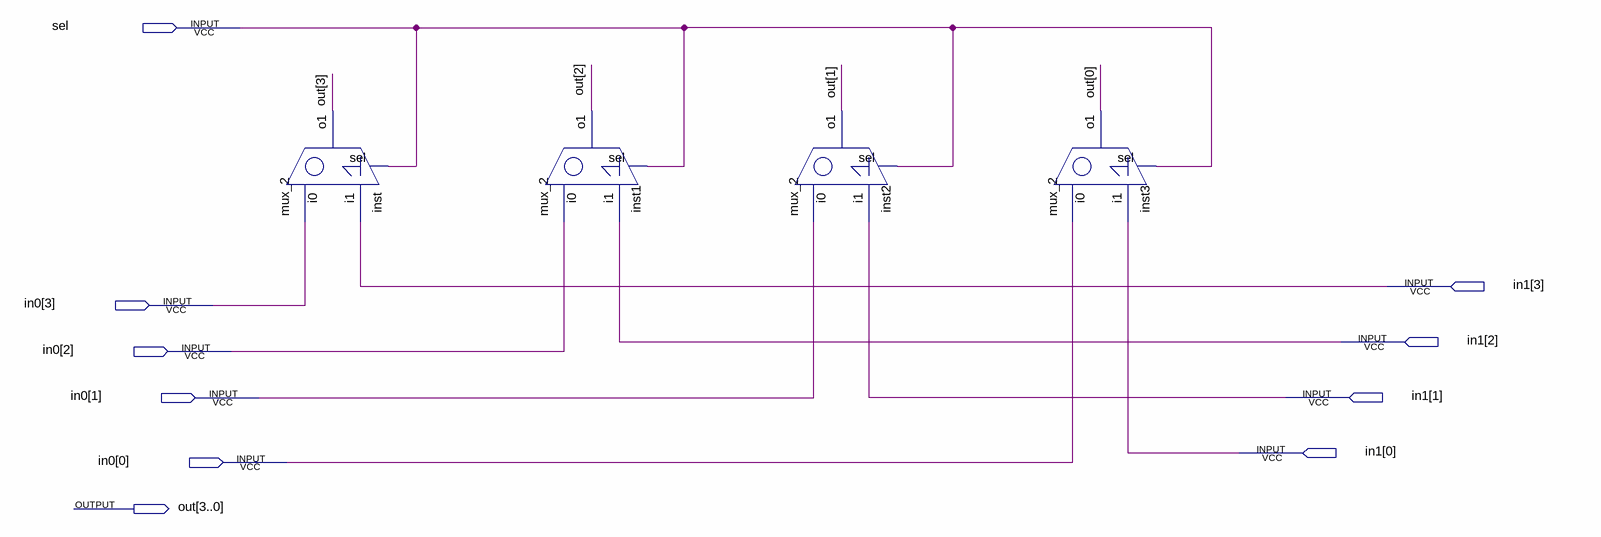
[diagram p0: schematic sheet]
// Quartus schematic MUX4.bdf as structural Verilog: 4 symbols, 10 pins
module MUX4 (
  input  sel,
  input  [3:0] in1,
  input  [3:0] in0,
  output [3:0] out
);

  mux_2 inst (.sel(sel), .i0(in0[3]), .i1(in1[3]), .o1(out[3]));
  mux_2 inst1 (.sel(sel), .i0(in0[2]), .i1(in1[2]), .o1(out[2]));
  mux_2 inst2 (.sel(sel), .i0(in0[1]), .i1(in1[1]), .o1(out[1]));
  mux_2 inst3 (.sel(sel), .i0(in0[0]), .i1(in1[0]), .o1(out[0]));
endmodule
